# EAGLE board v1.0 (EAGLE 8.2.1), part 1 of 2
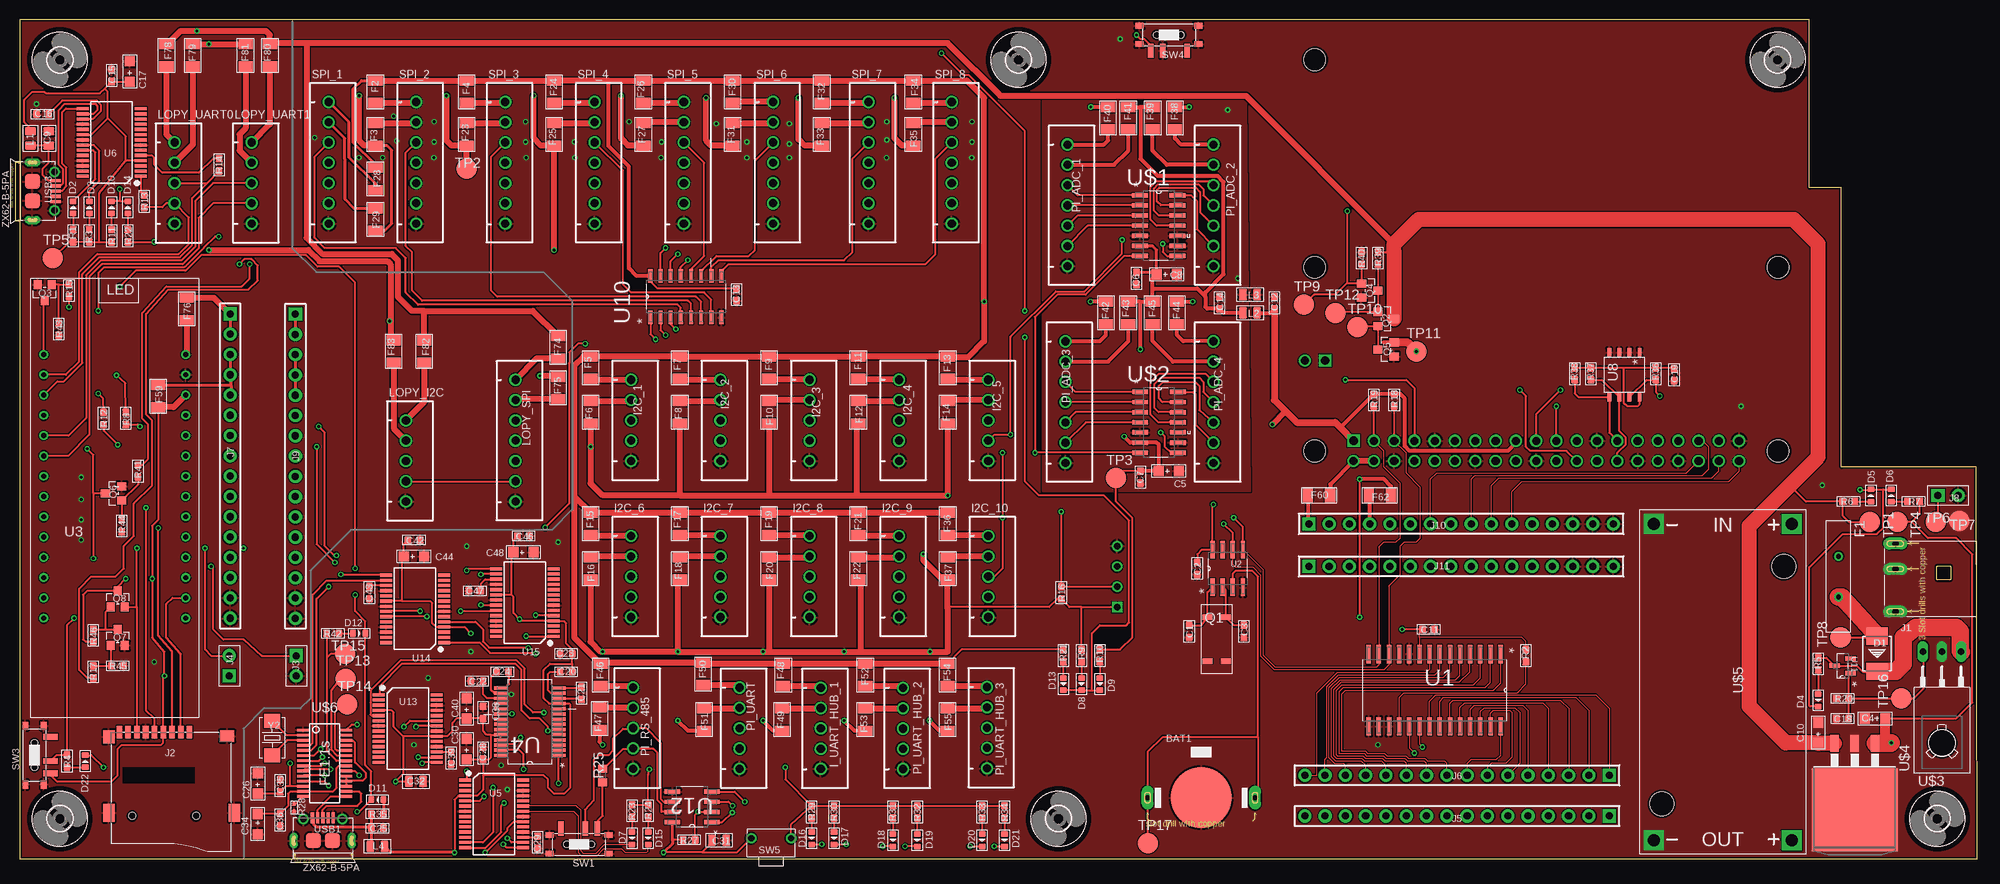
[diagram p8: board, top side]
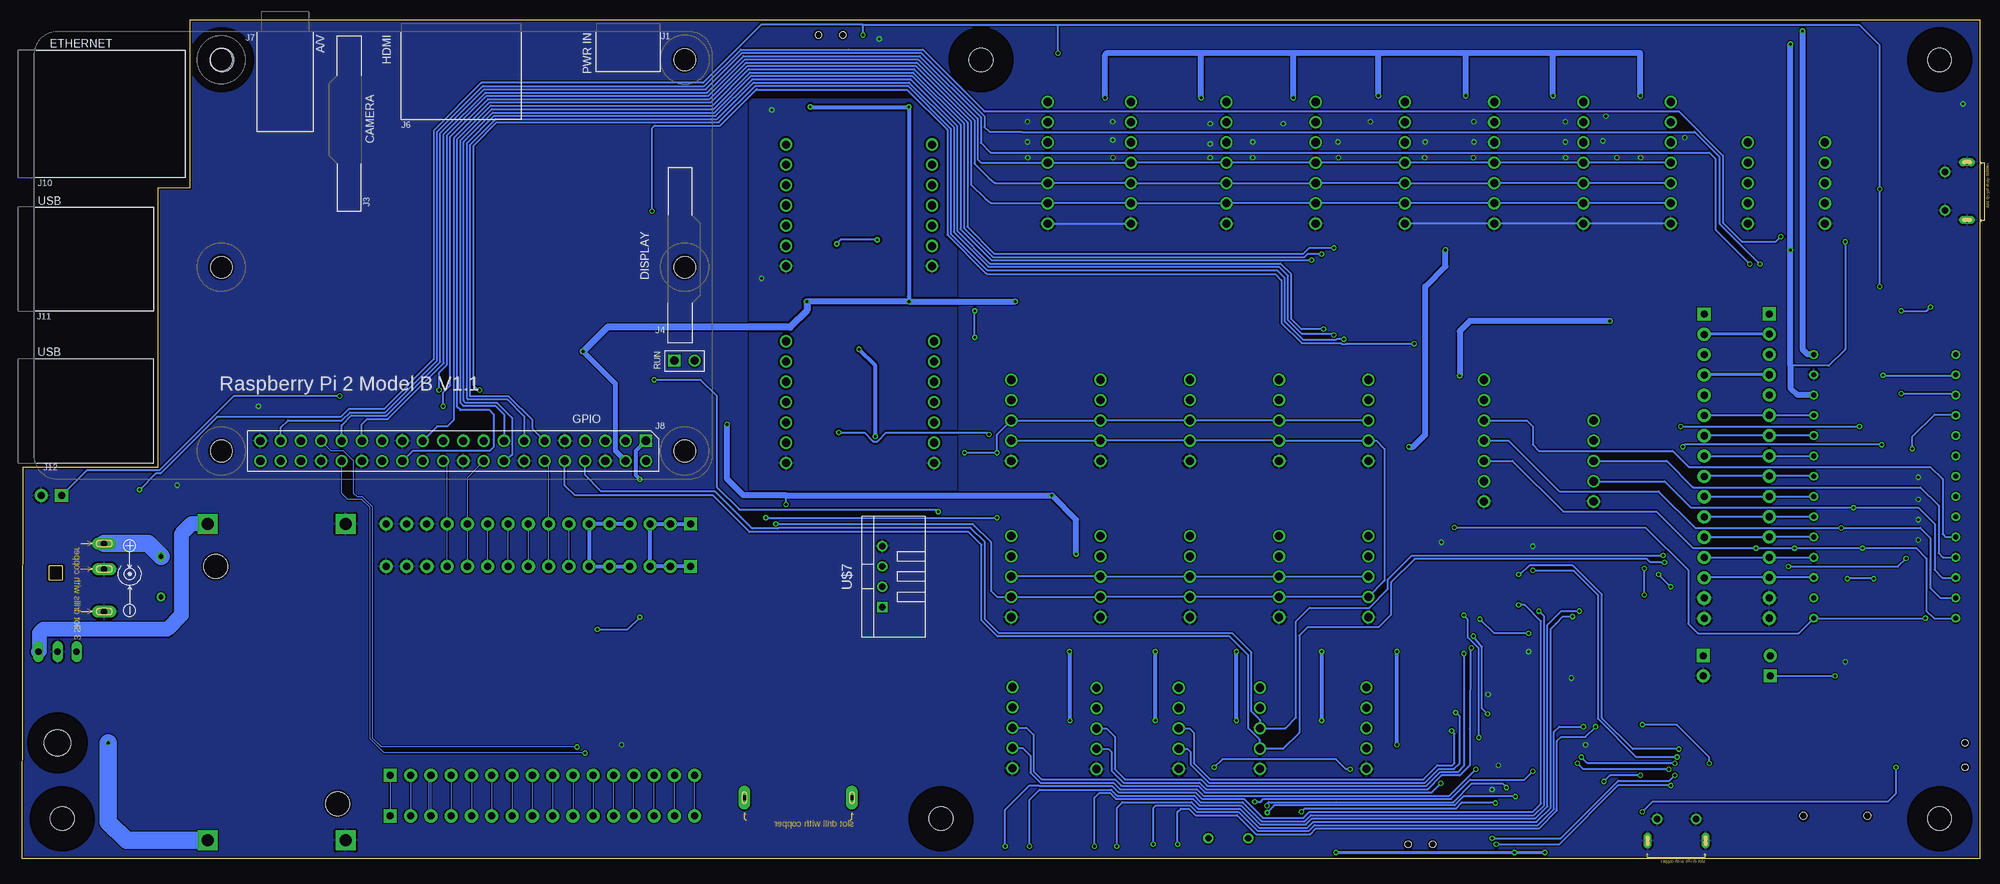
[diagram p9: board, bottom side, seen from below]

Size 245 x 105 mm. Coordinates in mm from the lower left corner, seen from the top.
Outline: 0,0 245,0 244.88,49 228,49 228,84 224,84 224,105 0,105 0,0
Copper layers (1*16): Top 0.035mm / dielectric 1.5mm / Bottom 0.035mm
Design rules "SeeedStudio_2layer_DRU_no_angle_20140221": minimum track width 6mil, minimum drill 12mil, track to track 6mil, track to pad 6mil, pad to pad 6mil, via to via 6mil, smd to smd 0mil, copper to edge 10mil, drill to drill 10mil, minimum pad ring 10mil, minimum via ring 6mil, stop-mask expansion 2mil, vias tented up to drill 100mil, thermal gap 10mil

## Footprints (pad centres in the part's own frame; a part is rotated, then mirrored left to right if it is on the bottom)
BAT2P-13.5-CR1220 = drill 0.635 pad 1.524 long: +1 6.731,0; +2 -6.731,0 | smd 7.62 x 7.62: - 0,0
C0603 = smd 0.889 x 0.889: 1 0,0.762; 2 0,-0.762
AVX-A = smd 1.27 x 1.27: + -1.27,0; - 1.27,0
C0805 = smd 1.397 x 1.016: 1 0,0.889; 2 0,-0.889
DO-214AA = smd 2.159 x 2.743: + -2.21,0; - 2.21,0
LED-0603 = smd 0.762 x 0.889: + -0.762,0; - 0.762,0
TH_5MM_14MM = drill 0.6: P$1 -2.54,0; P$2 2.54,0
F1206 = smd 1.27 x 1.778: 1 -1.397,0; 2 1.397,0
3,0 = hole 3: 0,0
JST-XH-05-PACKAGE-ROUND-PAD = drill 1.016: 1 -5.08,0; 2 -2.54,0; 3 0,0; 4 2.54,0; 5 5.08,0
DCJ3P-11.6X9.6X7.0MM = drill 0.813 pad 1.524 long: + 4.381,10.16; - -4.128,10.16; CDN 1.206,10.16
MICRO-SD9+4P-SMD-16.1X14.5X1.85MM = smd 1.6 x 0.7: 1 0,2.25; 2 0,1.15; 3 0,0.05; 4 0,-1.05; 5 0,-2.15; 6 0,-3.25; 7 0,-4.35; 8 0,-5.45; 9 0,-6.55 | smd 1.6 x 1.4: G1 0.6,-7.85 | smd 2.2 x 1.4: G2 10.1,-7.85; G3 10.1,7.85 | smd 1.4 x 1.8: G4 0.5,6.95 | hole 0.9: 10.5,-4.95; 10.5,3.05
H2-2.54 = drill 0.889 pad 1.651 square: 1 0,1.27 | drill 0.889 pad 1.651: 2 0,-1.27
H16-2.54 = drill 0.889 pad 1.651 square: 1 0,-19.05 | drill 0.889 pad 1.651: 2 0,-16.51; 3 0,-13.97; 4 0,-11.43; 5 0,-8.89; 6 0,-6.35; 7 0,-3.81; 8 0,-1.27; 9 0,1.27; 10 0,3.81; 11 0,6.35; 12 0,8.89; 13 0,11.43; 14 0,13.97; 15 0,16.51; 16 0,19.05
L0805 = smd 1.016 x 1.397: 1 -0.889,0; 2 0.889,0
JST-XH-07-PACKAGE-ROUND-PAD = drill 1.016: 1 -7.62,0; 2 -5.08,0; 3 -2.54,0; 4 0,0; 5 2.54,0; 6 5.08,0; 7 7.62,0
RPI2 = drill 1.016 square: P$1 8.37,51.23; P$41 4.8,41.2 | drill 1.016: P$2 8.357,53.772; P$3 10.897,51.232; P$4 10.897,53.772; P$5 13.437,51.232; P$6 13.437,53.772; P$7 15.977,51.232; P$8 15.977,53.772; P$9 18.517,51.232; P$10 18.517,53.772; P$11 21.057,51.232; P$12 21.057,53.772; P$13 23.597,51.232; P$14 23.597,53.772; P$15 26.137,51.232; P$16 26.137,53.772; P$17 28.677,51.232; P$18 28.677,53.772; P$19 31.217,51.232; P$20 31.217,53.772; P$21 33.757,51.232; P$22 33.757,53.772; P$23 36.297,51.232; P$24 36.297,53.772; P$25 38.837,51.232; P$26 38.837,53.772; P$27 41.377,51.232; P$28 41.377,53.772; P$29 43.917,51.232; P$30 43.917,53.772; P$31 46.457,51.232; P$32 46.457,53.772; P$33 48.997,51.232; P$34 48.997,53.772; P$35 51.537,51.232; P$36 51.537,53.772; P$37 54.077,51.232; P$38 54.077,53.772; P$39 56.617,51.232; P$40 56.617,53.772; P$42 2.26,41.2 | hole 2.75: 3.5,3.5; 61.5,3.5; 3.5,52.5; 61.5,52.5; 61.5,29.5; 3.5,29.5
85SMX = smd 0.635 x 1.27: 1 0,0; 2 5.5,0; 3 5.5,2.3; 4 0,2.3
SOT-23 = smd 1.016 x 1.143: 1 -0.889,-1.016; 2 0.889,-1.016; 3 0,1.016
R0603 = smd 0.889 x 0.889: 1 0,0.762; 2 0,-0.762
R0603' = smd 1 x 1.1: 1 -0.85,0; 2 0.85,0
R0402 = smd 0.5 x 0.5: 1 0,0.463; 2 0,-0.463
SW7-SMD-L6.7X2.7X3.2MM = smd 1.8 x 0.7: A 1.978,2.286; B 1.978,-2.286; COM 1.978,-0.762 | smd 0.7 x 1.016: SS1 -1.15,-3.683; SS2 1.15,-3.683; SS3 1.15,3.683; SS4 -1.15,3.683 | hole 0.813: 0,-1.524; 0,1.524
SW2-5.0-6.0X3.0X4.3MM = drill 0.8 pad 1.27: 1 -2.5,0; 2 2.5,0
B2,54 = smd 2.54 x 2.54: TP 0,0
SOIC127P1032X265-28N = smd 2.286 x 0.559: 1 -4.521,8.255; 2 -4.521,6.985; 3 -4.521,5.715; 4 -4.521,4.445; 5 -4.521,3.175; 6 -4.521,1.905; 7 -4.521,0.635; 8 -4.521,-0.635; 9 -4.521,-1.905; 10 -4.521,-3.175; 11 -4.521,-4.445; 12 -4.521,-5.715; 13 -4.521,-6.985; 14 -4.521,-8.255; 15 4.521,-8.255; 16 4.521,-6.985; 17 4.521,-5.715; 18 4.521,-4.445; 19 4.521,-3.175; 20 4.521,-1.905; 21 4.521,-0.635; 22 4.521,0.635; 23 4.521,1.905; 24 4.521,3.175; 25 4.521,4.445; 26 4.521,5.715; 27 4.521,6.985; 28 4.521,8.255
SOIC127P600X175-8N = smd 2.184 x 0.559: 1 -2.362,1.905; 2 -2.362,0.635; 3 -2.362,-0.635; 4 -2.362,-1.905; 5 2.362,-1.905; 6 2.362,-0.635; 7 2.362,0.635; 8 2.362,1.905
LOPY = drill 0.6: P$1 -8.89,16.51; P$2 -8.89,13.97; P$3 -8.89,11.43; P$4 -8.89,8.89; P$5 -8.89,6.35; P$6 -8.89,3.81; P$7 -8.89,1.27; P$8 -8.89,-1.27; P$9 -8.89,-3.81; P$10 -8.89,-6.35; P$11 -8.89,-8.89; P$12 -8.89,-11.43; P$13 -8.89,-13.97; P$14 -8.89,-16.51; P$15 8.89,-16.51; P$16 8.89,-13.97; P$17 8.89,-11.43; P$18 8.89,-8.89; P$19 8.89,-6.35; P$20 8.89,-3.81; P$21 8.89,-1.27; P$22 8.89,1.27; P$23 8.89,3.81; P$24 8.89,6.35; P$25 8.89,8.89; P$26 8.89,11.43; P$27 8.89,13.97; P$28 8.89,16.51
SOP65P780X200-28N = smd 1.651 x 0.432: 1 -3.632,4.216; 2 -3.632,3.581; 3 -3.632,2.921; 4 -3.632,2.286; 5 -3.632,1.626; 6 -3.632,0.965; 7 -3.632,0.33; 8 -3.632,-0.33; 9 -3.632,-0.965; 10 -3.632,-1.626; 11 -3.632,-2.286; 12 -3.632,-2.921; 13 -3.632,-3.581; 14 -3.632,-4.216; 15 3.632,-4.216; 16 3.632,-3.581; 17 3.632,-2.921; 18 3.632,-2.286; 19 3.632,-1.626; 20 3.632,-0.965; 21 3.632,-0.33; 22 3.632,0.33; 23 3.632,0.965; 24 3.632,1.626; 25 3.632,2.286; 26 3.632,2.921; 27 3.632,3.581; 28 3.632,4.216
SSOP28-0.65-10.2X5.2MM = smd 0.4 x 1.5: 1 -4.225,-3.625; 2 -3.575,-3.625; 3 -2.925,-3.625; 4 -2.275,-3.625; 5 -1.625,-3.625; 6 -0.975,-3.625; 7 -0.325,-3.625; 8 0.325,-3.625; 9 0.975,-3.625; 10 1.625,-3.625; 11 2.275,-3.625; 12 2.925,-3.625; 13 3.575,-3.625; 14 4.225,-3.625; 15 4.225,3.625; 16 3.575,3.625; 17 2.925,3.625; 18 2.275,3.625; 19 1.625,3.625; 20 0.975,3.625; 21 0.325,3.625; 22 -0.325,3.625; 23 -0.975,3.625; 24 -1.625,3.625; 25 -2.275,3.625; 26 -2.925,3.625; 27 -3.575,3.625; 28 -4.225,3.625
SOP8 = smd 1 x 0.5: 1 -2.8,1.905; 2 -2.8,0.635; 3 -2.8,-0.635; 4 -2.8,-1.905; 5 2.8,-1.905; 6 2.8,-0.635; 7 2.8,0.635; 8 2.8,1.905
SOIC127P600X175-16N = smd 1.702 x 0.533: 1 -2.591,4.445; 2 -2.591,3.175; 3 -2.591,1.905; 4 -2.591,0.635; 5 -2.591,-0.635; 6 -2.591,-1.905; 7 -2.591,-3.175; 8 -2.591,-4.445; 9 2.591,-4.445; 10 2.591,-3.175; 11 2.591,-1.905; 12 2.591,-0.635; 13 2.591,0.635; 14 2.591,1.905; 15 2.591,3.175; 16 2.591,4.445
SOT91P240X110-3N = smd 1.321 x 0.559: 1 -1.016,0.914; 2 -1.016,-0.914; 3 1.016,0
SOIC127P600X175-8N' = smd 1.981 x 0.533: 1 -2.464,1.905; 2 -2.464,0.635; 3 -2.464,-0.635; 4 -2.464,-1.905; 5 2.464,-1.905; 6 2.464,-0.635; 7 2.464,0.635; 8 2.464,1.905
SOIC127P600X175-14N = smd 1.981 x 0.559: 1 -2.362,3.81; 2 -2.362,2.54; 3 -2.362,1.27; 4 -2.362,0; 5 -2.362,-1.27; 6 -2.362,-2.54; 7 -2.362,-3.81; 8 2.362,-3.81; 9 2.362,-2.54; 10 2.362,-1.27; 11 2.362,0; 12 2.362,1.27; 13 2.362,2.54; 14 2.362,3.81
TO-225AA = drill 0.813 long: 1 -4.921,-8.89; 2 -2.54,-8.89; 3 -0.159,-8.89 | hole 3.302: -2.54,2.54
TO-263 = smd 1.067 x 2.159: 1 -2.54,-8.331; 2 0,-8.331; 3 2.54,-8.331 | smd 10.8 x 10.41: TAB 0,0
DC-DC-STEP-DOWN-LM2596 = drill 1.5 pad 2.5 square: IN+ -19.812,8.636; IN- -19.812,-8.636; OUT+ 19.812,8.636; OUT- 19.812,-8.636 | hole 3: -14.478,7.62; 15.24,-7.62
FE1.1S_SSOP-28 = smd 0.35 x 1.5: 1 -4.16,-2.7; 2 -3.52,-2.7; 3 -2.88,-2.7; 4 -2.24,-2.7; 5 -1.6,-2.7; 6 -0.96,-2.7; 7 -0.32,-2.7; 8 0.32,-2.7; 9 0.96,-2.7; 10 1.6,-2.7; 11 2.24,-2.7; 12 2.88,-2.7; 13 3.52,-2.7; 14 4.16,-2.7; 15 4.16,2.7; 16 3.52,2.7; 17 2.88,2.7; 18 2.24,2.7; 19 1.6,2.7; 20 0.96,2.7; 21 0.32,2.7; 22 -0.3,2.7; 23 -0.96,2.7; 24 -1.6,2.7; 25 -2.24,2.7; 26 -2.88,2.7; 27 -3.52,2.7; 28 -4.16,2.7
TEMP-HUM-SENSOR-DHT22 = drill 0.8 square: 1 -3.81,0 | drill 0.8: 2 -1.27,0; 3 1.27,0; 4 3.81,0
MICRO-USB5+6P-SMD-0.65-AB = smd 0.4 x 1.35: 1 -1.3,2.875; 2 -0.65,2.875; 3 0,2.875; 4 0.65,2.875; 5 1.3,2.875 | smd 1.9 x 1.9: P1 -1.2,0; P2 1.2,0 | drill 0.508 pad 1.016 long: P3 -3.625,0; P4 3.625,0 | drill 0.8: P5 -2.425,2.73; P6 2.425,2.73
X2-SMD-5.0X3.2X1.3MM = smd 1.778 x 2.032: 1 -2.159,0; 2 2.159,0

## Placement (x,y rotation side)
BAT1  cr1220  [BAT2P-13.5-CR1220]  147.87,7.62 0 top
C1  10pf  [C0603]  146.35,28.45 0 top
C2  100nf  [C0603]  147.36,36.32 180 top
C3  10pf  [C0603]  153.2,28.45 0 top
C4  10uf  [AVX-A]  232.2,17.53 180 top
C5  10uf  [AVX-A]  143.81,48.51 0 top
C6  100nf  [C0603]  139.74,72.64 180 top
C7  100nf  [C0603]  140.25,47.75 180 top
C8  10uf  [AVX-A]  143.55,73.15 0 top
C9  10nf  [C0805]  3.6,90.17 0 top
C10  10uf  [AVX-A]  225.09,15.75 90 top
C11  100nf  [C0603]  176.32,28.7 270 top
C12  100nf  [C0603]  157.01,69.6 0 top
C13  100nf  [C0603]  89.7,70.61 180 top
C14  100nf  [C0603]  150.16,69.6 0 top
C15  100nf  [C0603]  11.47,98.04 0 top
C16  100nf  [C0603]  2.84,93.22 90 top
C17  4.7uf  [AVX-A]  13.76,98.55 90 top
C18  100nf  [C0603]  228.13,17.53 90 top
C19  100nf  [C0603]  207.05,60.58 0 top
C20  100nf  [C0603]  68.37,23.37 90 top
C21  100nf  [C0603]  70.29,20.7 180 top
C22  100nf  [C0603]  57.2,22.22 270 top
C23  100nf  [C0603]  68.37,25.65 90 top
C24  100nf  [C0603]  60.39,23.38 90 top
C25  10nf  [C0603]  44.75,3.81 270 top
C26  10uf  [AVX-A]  29.78,9.41 90 top
C28  100nf  [C0603]  57.95,13.21 0 top
C29  100nf  [C0603]  64.81,2.03 180 top
C30  4.7uf  [AVX-A]  55.92,13.72 90 top
C31  100nf  [C0805]  87.51,2.28 270 top
C32  10uf  [C0805]  49.57,9.65 90 top
C34  10uf  [AVX-A]  29.74,4.31 270 top
C35  100nf  [C0603]  32.57,9.12 0 top
C36  100nf  [C0603]  32.58,4.84 180 top
C38  100nf  [C0603]  57.95,18.29 0 top
C39  100nf  [C0603]  53.97,12.6 180 top
C40  47uf  [AVX-A]  55.92,18.8 90 top
C42  100nf  [C0603]  49.32,39.88 270 top
C43  100nf  [C0603]  43.73,33.27 180 top
C44  47uf  [AVX-A]  49.32,37.85 0 top
C46  100nf  [C0603]  63.03,40.39 270 top
C47  100nf  [C0603]  56.94,33.53 90 top
C48  47uf  [AVX-A]  63.03,38.35 0 top
D1  28V-5A  [DO-214AA]  232.45,25.65 270 top
D2  BLUE-0603  [LED-0603]  6.65,81.53 90 top
D3  GREEN-0603  [LED-0603]  8.68,81.53 90 top
D4  RED-0603  [LED-0603]  225.09,19.81 270 top
D5  RED-0603  [LED-0603]  231.69,45.47 90 top
D6  RED-0603  [LED-0603]  234.23,45.47 90 top
D7  BLUE-0603  [LED-0603]  76.61,2.54 270 top
D8  RED-0603  [LED-0603]  132.88,21.84 270 top
D9  RED-0603  [LED-0603]  135.17,21.84 270 top
D10  RED-0603  [LED-0603]  11.47,81.53 90 top
D11  BLUE-0603  [LED-0603]  44.75,7.37 180 top
D12  YELLOW-WHITE-0603  [LED-0603]  42.46,28.19 0 top
D13  RED-0603  [LED-0603]  130.6,21.84 270 top
D14  RED-0603  [LED-0603]  13.5,81.53 90 top
D15  GREEN-0603  [LED-0603]  78.64,2.54 270 top
D16  BLUE-0603  [LED-0603]  99.1,2.54 270 top
D17  GREEN-0603  [LED-0603]  101.9,2.54 270 top
D18  BLUE-0603  [LED-0603]  109.26,2.29 270 top
D19  GREEN-0603  [LED-0603]  112.31,2.29 270 top
D20  BLUE-0603  [LED-0603]  120.44,2.29 270 top
D21  GREEN-0603  [LED-0603]  123.23,2.29 270 top
D22  RED-0603  [LED-0603]  8.17,12.19 90 top
F1  307010005_DIP_PPTC_4A_0310  [TH_5MM_14MM]  227.63,35.31 270 top
F2  SMD1206R500SF  [F1206]  44.49,96.01 270 top
F3  SMD1206R500SF  [F1206]  44.49,90.68 90 top
F4  SMD1206R500SF  [F1206]  55.92,96.01 270 top
F5  SMD1206R500SF  [F1206]  71.42,61.47 270 top
F6  SMD1206R500SF  [F1206]  71.42,55.88 90 top
F7  SMD1206R500SF  [F1206]  82.59,61.47 270 top
F8  SMD1206R500SF  [F1206]  82.59,55.88 90 top
F9  SMD1206R500SF  [F1206]  93.77,61.47 270 top
F10  SMD1206R500SF  [F1206]  93.77,55.88 90 top
F11  SMD1206R500SF  [F1206]  104.94,61.47 270 top
F12  SMD1206R500SF  [F1206]  104.94,55.88 90 top
F13  SMD1206R500SF  [F1206]  116.12,61.47 270 top
F14  SMD1206R500SF  [F1206]  116.12,55.88 90 top
F15  SMD1206R500SF  [F1206]  71.42,41.91 270 top
F16  SMD1206R500SF  [F1206]  71.42,36.32 90 top
F17  SMD1206R500SF  [F1206]  82.59,41.91 270 top
F18  SMD1206R500SF  [F1206]  82.59,36.32 90 top
F19  SMD1206R500SF  [F1206]  93.77,41.91 270 top
F20  SMD1206R500SF  [F1206]  93.77,36.32 90 top
F21  SMD1206R500SF  [F1206]  104.94,41.91 270 top
F22  SMD1206R500SF  [F1206]  104.94,36.32 90 top
F23  SMD1206R500SF  [F1206]  55.92,90.68 90 top
F24  SMD1206R500SF  [F1206]  66.84,96.01 270 top
F25  SMD1206R500SF  [F1206]  66.84,90.68 90 top
F26  SMD1206R500SF  [F1206]  78.02,96.01 270 top
F27  SMD1206R500SF  [F1206]  78.02,90.68 90 top
F28  SMD1206R500SF  [F1206]  44.49,85.09 270 top
F29  SMD1206R500SF  [F1206]  44.49,80.01 90 top
F30  SMD1206R500SF  [F1206]  89.2,96.01 270 top
F31  SMD1206R500SF  [F1206]  89.2,90.68 90 top
F32  SMD1206R500SF  [F1206]  100.37,96.01 270 top
F33  SMD1206R500SF  [F1206]  100.37,90.68 90 top
F34  SMD1206R500SF  [F1206]  111.8,96.01 270 top
F35  SMD1206R500SF  [F1206]  111.8,90.68 90 top
F36  SMD1206R500SF  [F1206]  116.12,41.91 270 top
F37  SMD1206R500SF  [F1206]  116.12,36.32 90 top
F38  SMD1206R500SF  [F1206]  144.57,92.71 270 top
F39  SMD1206R500SF  [F1206]  141.77,92.71 270 top
F40  SMD1206R500SF  [F1206]  136.19,92.71 270 top
F41  SMD1206R500SF  [F1206]  138.73,92.71 270 top
F42  SMD1206R500SF  [F1206]  135.93,68.33 270 top
F43  SMD1206R500SF  [F1206]  138.73,68.33 270 top
F44  SMD1206R500SF  [F1206]  144.82,68.33 270 top
F45  SMD1206R500SF  [F1206]  141.77,68.33 270 top
F46  SMD1206R500SF  [F1206]  72.67,22.99 270 top
F47  SMD1206R500SF  [F1206]  72.55,17.53 90 top
F48  SMD1206R500SF  [F1206]  95.53,22.99 270 top
F49  SMD1206R500SF  [F1206]  95.41,17.4 90 top
F50  SMD1206R500SF  [F1206]  85.5,23.12 270 top
F51  SMD1206R500SF  [F1206]  85.63,17.4 90 top
F52  SMD1206R500SF  [F1206]  105.82,22.99 270 top
F53  SMD1206R500SF  [F1206]  105.82,17.4 90 top
F54  SMD1206R500SF  [F1206]  116.11,22.99 270 top
F55  SMD1206R500SF  [F1206]  116.11,17.4 90 top
F59  SMD1206R500SF  [F1206]  17.31,57.91 90 top
F60  SMD1206R500SF  [F1206]  162.6,45.47 180 top
F62  SMD1206R500SF  [F1206]  170.22,45.47 180 top
F74  SMD1206R500SF  [F1206]  67.35,64.01 270 top
F75  SMD1206R500SF  [F1206]  67.35,58.93 270 top
F76  SMD1206R500SF  [F1206]  20.87,68.83 90 top
F78  SMD1206R500SF  [F1206]  18.33,100.58 270 top
F79  SMD1206R500SF  [F1206]  21.63,100.58 270 top
F80  SMD1206R500SF  [F1206]  31.28,100.58 270 top
F81  SMD1206R500SF  [F1206]  28.24,100.58 270 top
F82  SMD1206R500SF  [F1206]  50.59,63.5 270 top
F83  SMD1206R500SF  [F1206]  46.78,63.5 270 top
H1  MOUNT-HOLE3.0  [3,0]  220,100 0 top
H2  MOUNT-HOLE3.0  [3,0]  130,5 0 top
H3  MOUNT-HOLE3.0  [3,0]  240,5 0 top
H4  MOUNT-HOLE3.0  [3,0]  125,100 0 top
H5  MOUNT-HOLE3.0  [3,0]  5,5 0 top
H6  MOUNT-HOLE3.0  [3,0]  5,100 0 top
I2C_1  JST-XH-05-PIN-ROUND-PAD  [JST-XH-05-PACKAGE-ROUND-PAD]  76.5,54.86 270 top
I2C_2  JST-XH-05-PIN-ROUND-PAD  [JST-XH-05-PACKAGE-ROUND-PAD]  87.67,54.86 270 top
I2C_3  JST-XH-05-PIN-ROUND-PAD  [JST-XH-05-PACKAGE-ROUND-PAD]  98.85,54.86 270 top
I2C_4  JST-XH-05-PIN-ROUND-PAD  [JST-XH-05-PACKAGE-ROUND-PAD]  110.02,54.86 270 top
I2C_5  JST-XH-05-PIN-ROUND-PAD  [JST-XH-05-PACKAGE-ROUND-PAD]  121.2,54.86 270 top
I2C_6  JST-XH-05-PIN-ROUND-PAD  [JST-XH-05-PACKAGE-ROUND-PAD]  76.5,35.31 270 top
I2C_7  JST-XH-05-PIN-ROUND-PAD  [JST-XH-05-PACKAGE-ROUND-PAD]  87.67,35.31 270 top
I2C_8  JST-XH-05-PIN-ROUND-PAD  [JST-XH-05-PACKAGE-ROUND-PAD]  98.85,35.31 270 top
I2C_9  JST-XH-05-PIN-ROUND-PAD  [JST-XH-05-PACKAGE-ROUND-PAD]  110.02,35.31 270 top
I2C_10  JST-XH-05-PIN-ROUND-PAD  [JST-XH-05-PACKAGE-ROUND-PAD]  121.2,35.31 270 top
I_UART_HUB_1  JST-XH-05-PIN-ROUND-PAD  [JST-XH-05-PACKAGE-ROUND-PAD]  100.23,16.3 270 top
J1  DC-044-A  [DCJ3P-11.6X9.6X7.0MM]  244.9,35.05 90 top
J2  MICROSD-9P  [MICRO-SD9+4P-SMD-16.1X14.5X1.85MM]  18.99,15.83 270 top
J3  2p-2.54  [H2-2.54]  34.59,24.13 0 top
J4  2p-2.54  [H2-2.54]  26.2,24.13 180 top
J5  16p-2.54  [H16-2.54]  179.87,5.33 90 top
J6  16p-2.54  [H16-2.54]  179.87,10.41 90 top
J7  16p-2.54  [H16-2.54]  26.31,49.15 180 top
J8  2p-2.54  [H2-2.54]  241.34,45.47 90 top
J9  16p-2.54  [H16-2.54]  34.47,49.12 180 top
J10  16p-2.54  [H16-2.54]  180.38,41.91 270 top
J11  16p-2.54  [H16-2.54]  180.38,36.58 270 top
L1  330R-1500MA  [L0805]  1.31,90.17 90 top
L2  330R-1500MA  [L0805]  153.97,68.33 180 top
L3  330R-1500MA  [L0805]  153.97,70.61 180 top
L4  330R-1500MA  [L0805]  44.75,1.52 0 top
LOPY_I2C  JST-XH-05-PIN-ROUND-PAD  [JST-XH-05-PACKAGE-ROUND-PAD]  48.3,49.78 270 top
LOPY_SPI  JST-XH-07-PIN-ROUND-PAD  [JST-XH-07-PACKAGE-ROUND-PAD]  62.02,52.32 270 top
LOPY_UART0  JST-XH-05-PIN-ROUND-PAD  [JST-XH-05-PACKAGE-ROUND-PAD]  19.35,84.58 270 top
LOPY_UART1  JST-XH-05-PIN-ROUND-PAD  [JST-XH-05-PACKAGE-ROUND-PAD]  29,84.58 270 top
PCB1  RPI2  [RPI2]  158.57,103.54 180 bottom
PI_ADC_1  JST-XH-07-PIN-ROUND-PAD  [JST-XH-07-PACKAGE-ROUND-PAD]  131.11,81.79 270 top
PI_ADC_2  JST-XH-07-PIN-ROUND-PAD  [JST-XH-07-PACKAGE-ROUND-PAD]  149.39,81.79 270 top
PI_ADC_3  JST-XH-07-PIN-ROUND-PAD  [JST-XH-07-PACKAGE-ROUND-PAD]  130.85,57.15 270 top
PI_ADC_4  JST-XH-07-PIN-ROUND-PAD  [JST-XH-07-PACKAGE-ROUND-PAD]  149.39,57.15 270 top
PI_RS_485  JST-XH-05-PIN-ROUND-PAD  [JST-XH-05-PACKAGE-ROUND-PAD]  76.74,16.34 270 top
PI_UART  JST-XH-05-PIN-ROUND-PAD  [JST-XH-05-PACKAGE-ROUND-PAD]  90.07,16.32 270 top
PI_UART_HUB_2  JST-XH-05-PIN-ROUND-PAD  [JST-XH-05-PACKAGE-ROUND-PAD]  110.52,16.28 270 top
PI_UART_HUB_3  JST-XH-05-PIN-ROUND-PAD  [JST-XH-05-PACKAGE-ROUND-PAD]  121.06,16.39 270 top
Q1  32.768khZ@6Pf  [85SMX]  148.63,30.23 270 top
Q2  SSM3J328R,LF  [SOT-23]  170.98,67.56 270 top
Q3  BSS138W-7-F  [SOT-23]  3.09,70.87 180 top
Q4  BSS138W-7-F  [SOT-23]  168.95,71.12 270 top
Q5  SSM3J328R,LF  [SOT-23]  170.98,63.75 90 top
Q6  BSS138W-7-F  [SOT-23]  11.73,45.72 90 top
Q7  BSS138W-7-F  [SOT-23]  12.23,27.69 0 top
Q8  CJ2305  [SOT-23]  12.23,32.51 0 top
R1  330R  [R0603]  6.65,77.98 180 top
R2  10K 1/10W  [R0603]  188.51,25.4 180 top
R3  330R  [R0603]  8.68,77.98 180 top
R4  220R  [R0603]  5.88,12.19 180 top
R5  1K  [R0603]  225.09,24.38 180 top
R6  220R  [R0603]  228.9,44.7 270 top
R7  330R  [R0603]  237.02,44.7 90 top
R8  0R  [R0603]  13.25,55.12 0 top
R9  100R  [R0603]  132.88,25.4 180 top
R10  100R  [R0603]  135.17,25.4 180 top
R11  1K  [R0603]  11.47,77.98 0 top
R12  0R  [R0603]  10.46,55.12 0 top
R13  0R  [R0603]  15.54,82.3 0 top
R14  0R  [R0603]  24.93,86.87 0 top
R15  0R  [R0603]  6.14,71.12 180 top
R16  10K  [R0603]  130.34,33.27 0 top
R17  0R  [R0603]  9.19,23.37 0 top
R18  10K  [R0603]  172,57.4 180 top
R19  10K  [R0603]  169.46,57.4 180 top
R20  15K 1/10W  [R0603]  228.13,20.07 90 top
R21  220R  [R0603]  130.6,25.4 180 top
R22  100R  [R0603]  13.5,77.98 0 top
R23  330R  [R0603]  76.61,5.97 0 top
R24  330R  [R0603]  78.64,5.97 0 top
R25  120R  [R0603']  72.94,10.41 90 top
R27  10K  [R0603]  83.76,2.34 270 top
R28  2.7K 1/16W  [R0402]  34.32,6.37 180 top
R29  330R  [R0603]  99.1,5.84 0 top
R30  330R  [R0603]  101.9,5.84 0 top
R31  330R  [R0603]  109.26,5.84 0 top
R32  330R  [R0603]  112.31,5.84 0 top
R33  330R  [R0603]  120.44,5.84 0 top
R34  330R  [R0603]  123.23,5.84 0 top
R35  1K  [R0603]  44.75,5.59 270 top
R36  1K  [R0603]  204.77,60.71 180 top
R37  3.9K  [R0603]  196.64,60.71 180 top
R38  3.9K  [R0603]  194.61,60.71 180 top
R39  100K 1/10W  [R0603]  169.97,75.18 180 top
R40  100K 1/10W  [R0603]  167.94,75.18 0 top
R41  0R  [R0603]  14.77,48.51 180 top
R42  330R  [R0603]  39.16,28.19 270 top
R43  100K 1/10W  [R0603]  4.87,66.29 180 top
R44  100K 1/10W  [R0603]  12.74,41.66 180 top
R45  100K 1/10W  [R0603]  12.23,24.13 270 top
R46  100K 1/10W  [R0603]  9.19,27.94 0 top
SPI_1  JST-XH-07-PIN-ROUND-PAD  [JST-XH-07-PACKAGE-ROUND-PAD]  38.65,87.12 270 top
SPI_2  JST-XH-07-PIN-ROUND-PAD  [JST-XH-07-PACKAGE-ROUND-PAD]  49.57,87.12 270 top
SPI_3  JST-XH-07-PIN-ROUND-PAD  [JST-XH-07-PACKAGE-ROUND-PAD]  60.75,87.12 270 top
SPI_4  JST-XH-07-PIN-ROUND-PAD  [JST-XH-07-PACKAGE-ROUND-PAD]  71.92,87.12 270 top
SPI_5  JST-XH-07-PIN-ROUND-PAD  [JST-XH-07-PACKAGE-ROUND-PAD]  83.1,87.12 270 top
SPI_6  JST-XH-07-PIN-ROUND-PAD  [JST-XH-07-PACKAGE-ROUND-PAD]  94.28,87.12 270 top
SPI_7  JST-XH-07-PIN-ROUND-PAD  [JST-XH-07-PACKAGE-ROUND-PAD]  106.21,87.12 270 top
SPI_8  JST-XH-07-PIN-ROUND-PAD  [JST-XH-07-PACKAGE-ROUND-PAD]  116.63,87.12 270 top
SW1  MK-12C02 G1.5  [SW7-SMD-L6.7X2.7X3.2MM]  69.99,1.78 90 top
SW3  MK-12C02 G1.5  [SW7-SMD-L6.7X2.7X3.2MM]  1.82,12.95 0 top
SW4  MK-12C02 G1.5  [SW7-SMD-L6.7X2.7X3.2MM]  143.81,103.12 270 top
SW5  TS-1101F  [SW2-5.0-6.0X3.0X4.3MM]  94.02,2.54 180 top
TP1  TPB2,54  [B2,54]  231.56,42.16 270 top
TP2  TPB2,54  [B2,54]  55.92,86.36 0 top
TP3  TPB2,54  [B2,54]  137.2,47.62 0 top
TP4  TPB2,54  [B2,54]  234.99,42.16 270 top
TP5  TPB2,54  [B2,54]  4.11,75.18 0 top
TP6  TPB2,54  [B2,54]  239.82,42.16 0 top
TP7  TPB2,54  [B2,54]  242.74,42.29 0 top
TP8  TPB2,54  [B2,54]  227.88,27.69 90 top
TP9  TPB2,54  [B2,54]  160.7,69.34 0 top
TP10  TPB2,54  [B2,54]  167.43,66.55 0 top
TP11  TPB2,54  [B2,54]  174.79,63.5 0 top
TP12  TPB2,54  [B2,54]  164.63,68.33 0 top
TP13  TPB2,54  [B2,54]  40.78,22.5 0 top
TP14  TPB2,54  [B2,54]  40.94,19.3 0 top
TP15  TPB2,54  [B2,54]  40.68,25.65 0 top
TP16  TPB2,54  [B2,54]  235.5,20.07 90 top
TP17  TPB2,54  [B2,54]  141.16,1.91 0 top
U1  MCP23017-E/SO  [SOIC127P1032X265-28N]  177.08,21.08 270 top
U2  MCP79412-I/SN  [SOIC127P600X175-8N]  151.17,36.32 90 top
U3  LOPY  [LOPY]  11.85,46.61 0 top
U4  MAX213IDBR  [SOP65P780X200-28N]  63.81,17.14 180 top
U5  FT232RL-SSOP28  [SSOP28-0.65-10.2X5.2MM]  59.34,5.6 270 top
U6  FT232RL-SSOP28  [SSOP28-0.65-10.2X5.2MM]  11.47,89.66 90 top
U8  BR24G32-3  [SOP8]  200.83,60.58 270 top
U10  74HCT139D  [SOIC127P600X175-16N]  83.35,70.36 90 top
U11  BZX84C30  [SOT91P240X110-3N]  228.13,24.13 180 top
U12  SP483ECN-L  [SOIC127P600X175-8N']  84.13,6.47 180 top
U13  FT232RL-SSOP28  [SSOP28-0.65-10.2X5.2MM]  48.54,16.29 270 top
U14  FT232RL-SSOP28  [SSOP28-0.65-10.2X5.2MM]  49.46,31.26 90 top
U15  FT232RL-SSOP28  [SSOP28-0.65-10.2X5.2MM]  63.2,32.05 90 top
U$1  MCP3424-E/SL  [SOIC127P600X175-14N]  142.54,79.25 0 top
U$2  MCP3424-E/SL  [SOIC127P600X175-14N]  142.57,54.62 0 top
U$3  C106DG  [TO-225AA]  238.04,17.02 180 top
U$4  MIC29300  [TO-263]  229.66,6.1 180 top
U$5  DC-DC-STEP-DOWN-LM2596  [DC-DC-STEP-DOWN-LM2596]  213.15,22.1 270 top
U$6  FE1.1S  [FE1.1S_SSOP-28]  38.14,11.94 270 top
U$7  TEMP-HUM-SENSOR-DHT22  [TEMP-HUM-SENSOR-DHT22]  137.33,35.31 90 bottom
USB1  ZX62-B-5PA  [MICRO-USB5+6P-SMD-0.65-AB]  37.91,2.24 0 top
USB3  ZX62-B-5PA  [MICRO-USB5+6P-SMD-0.65-AB]  1.57,83.57 270 top
Y2  12MHZ  [X2-SMD-5.0X3.2X1.3MM]  31.57,15.1 270 top